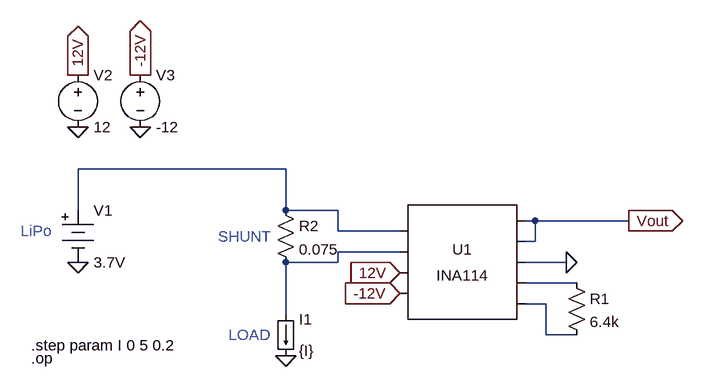
[diagram p0: schematic PM3.asc]
PM3.asc, the LTspice schematic file:
Version 4
SHEET 1 880 680
WIRE -80 -64 -400 -64
WIRE -400 0 -400 -64
WIRE -80 0 -80 -64
WIRE 0 0 -80 0
WIRE 304 16 288 16
WIRE 448 16 304 16
WIRE 0 32 0 0
WIRE 96 32 0 32
WIRE 304 48 304 16
WIRE 304 48 288 48
WIRE 96 64 0 64
WIRE 0 80 0 64
WIRE 0 80 -80 80
WIRE 352 80 288 80
WIRE 368 112 288 112
WIRE 320 144 288 144
WIRE -80 160 -80 80
WIRE 320 192 320 144
WIRE 368 192 320 192
FLAG 96 96 12V
IOPIN 96 96 In
FLAG 96 128 -12V
IOPIN 96 128 In
FLAG 352 80 0
FLAG 448 16 Vout
IOPIN 448 16 Out
FLAG -80 224 0
FLAG -400 80 0
FLAG -400 -128 0
FLAG -400 -208 12V
IOPIN -400 -208 Out
FLAG -304 -128 0
FLAG -304 -208 -12V
IOPIN -304 -208 Out
SYMBOL AutoGenerated\\INA114 192 80 R0
SYMATTR InstName U1
SYMBOL res 352 96 R0
SYMATTR InstName R1
SYMATTR Value 6.4k
SYMBOL res -96 -16 R0
SYMATTR InstName R2
SYMATTR Value 0.075
SYMBOL load -96 160 R0
SYMATTR InstName I1
SYMATTR Value {I}
SYMBOL Misc\\battery -400 -16 R0
SYMATTR InstName V1
SYMATTR Value 3.7V
SYMBOL voltage -400 -224 R0
SYMATTR InstName V2
SYMATTR Value 12
SYMBOL voltage -304 -224 R0
SYMATTR InstName V3
SYMATTR Value -12
TEXT -472 208 Left 2 !.step param I 0 5 0.2
TEXT -472 228 Left 2 !.op
TEXT -184 40 Left 2 ;SHUNT
TEXT -168 192 Left 2 ;LOAD
TEXT -488 32 Left 2 ;LiPo

The netlist it stands for:
* PM3.asc
* U1: INA114 (symbol AutoGenerated\INA114 not available, pins judged from their places): pin1=N001 pin2=N002 pin3=12V pin4=-12V pin5=Vout pin6=Vout pin7=0 pin8=N003 pin9=N004
R1 N003 N004 6.4k
R2 N001 N002 0.075
I1 N002 0 {I}
V1 N001 0 3.7V
V2 12V 0 12
V3 -12V 0 -12
.step param I 0 5 0.2
.op
* SHUNT
* LOAD
* LiPo
.backanno
.end